# Altium schematic sheet Schematic_RX.schdoc
size A1
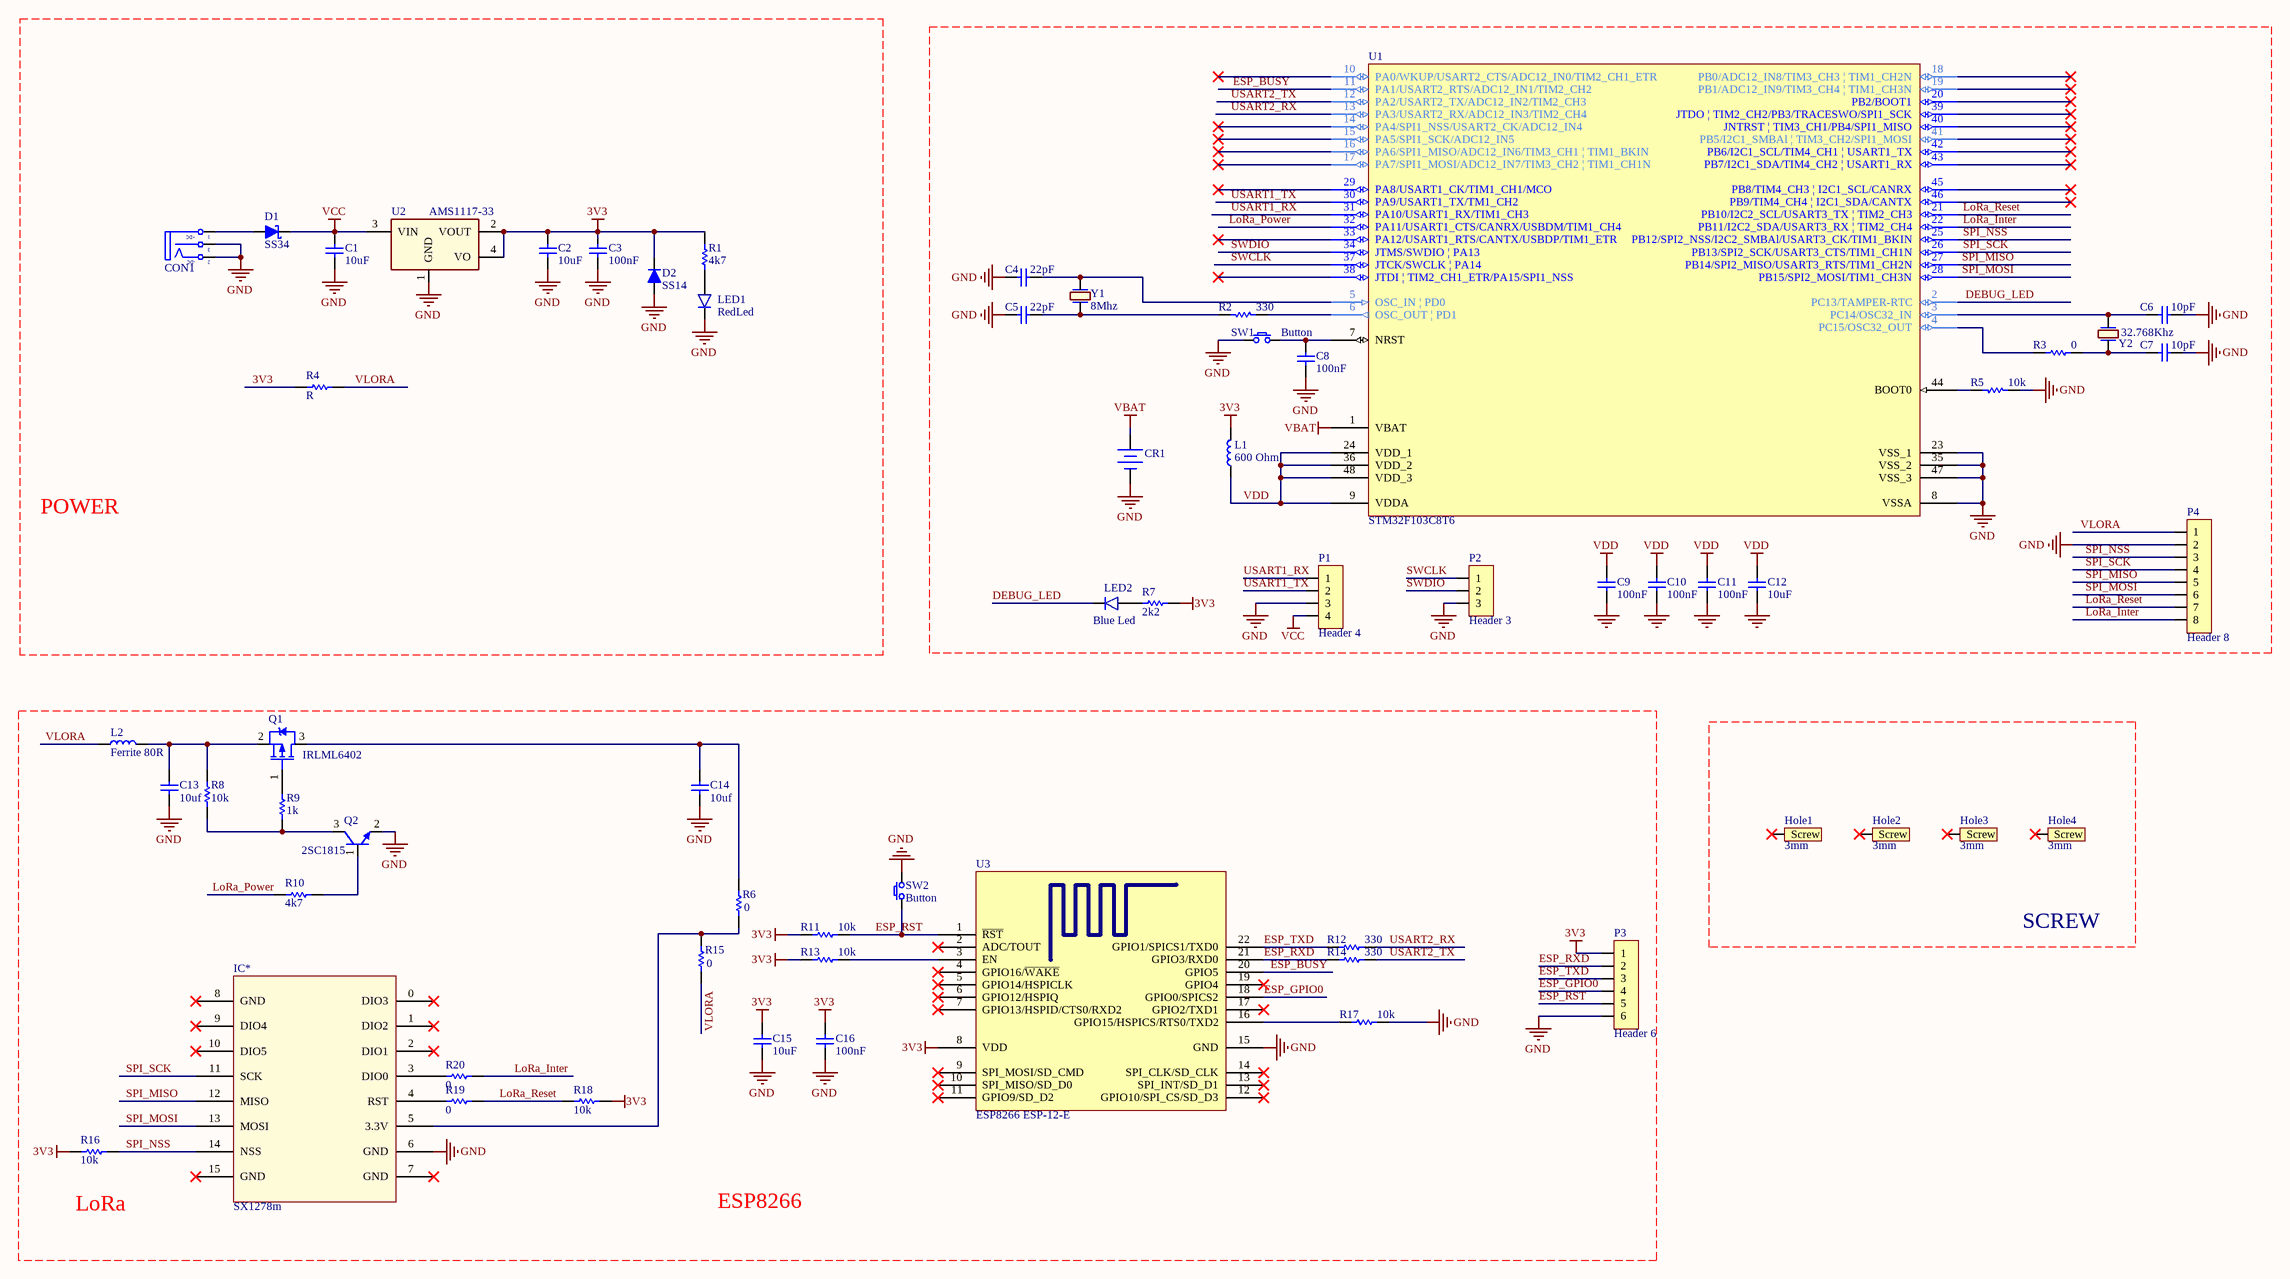
[diagram p0: Schematic_RX.schdoc]

## Parts
C1  10uF  [C 0805 (2012)]
C2  10uF  [C 0805 (2012)]
C3  100nF  [C 0805 (2012)]
C4  22pF  [C 0805 (2012)]
C5  22pF  [C 0805 (2012)]
C6  10pF  [C 0805 (2012)]
C7  10pF  [C 0805 (2012)]
C8  100nF  [C 0805 (2012)]
C9  100nF  [C 0805 (2012)]
C10  100nF  [C 0805 (2012)]
C11  100nF  [C 0805 (2012)]
C12  10uF  [C 0805 (2012)]
C13  10uf  [C 0805 (2012)]
C14  10uf  [C 0805 (2012)]
C15  10uF  [C 0805 (2012)]
C16  100nF  [C 0805 (2012)]
CON1  CON DC PWR  [CON DC-044]  (value not drawn)
CR1  (no value)  [CON CR1220]
D1  SS34  [DO-214AC (SMA)]
D2  SS14  [DO-214AC (SMA)]
Hole1  3mm  [SCREW/3M/7M]
Hole2  3mm  [SCREW/3M/7M]
Hole3  3mm  [SCREW/3M/7M]
Hole4  3mm  [SCREW/3M/7M]
IC*  SX1278m  [SX1287m]
L1  600 Ohm  [Inductor SMD 0805 (2012)]
L2  Ferrite 80R  [Inductor SMD 0805 (2012)]
LED1  RedLed  [Led SMD 0805]
LED2  Blue Led  [Led SMD 0805]
P1  Header 4  [CON Header 4]
P2  Header 3  [Header 3]
P3  Header 6  [CON Header 6]
P4  Header 8  [Header 8]
Q1  IRLML6402  [SOT-23]
Q2  2SC1815  [SOT-23]
R1  4k7  [R 0805 (2012)]
R2  330  [R 0805 (2012)]
R3  0  [R 0805 (2012)]
R4  R  [R 0805 (2012)]
R5  10k  [R 0805 (2012)]
R6  0  [R 0805 (2012)]
R7  2k2  [R 0805 (2012)]
R8  10k  [R 0805 (2012)]
R9  1k  [R 0805 (2012)]
R10  4k7  [R 0805 (2012)]
R11  10k  [R 0805 (2012)]
R12  330  [R 0805 (2012)]
R13  10k  [R 0805 (2012)]
R14  330  [R 0805 (2012)]
R15  0  [R 0805 (2012)]
R16  10k  [R 0805 (2012)]
R17  10k  [R 0805 (2012)]
R18  10k  [R 0805 (2012)]
R19  0  [R 0805 (2012)]
R20  0  [R 0805 (2012)]
SW1  Button  [SW/2/SMD]
SW2  Button  [SW/2/SMD]
U1  STM32F103C8T6  [LQFP48_N]
U2  AMS1117-33  [SOT-223]
U3  ESP8266 ESP-12-E  [ESP8266 ESP-12-E]
Y1  8Mhz  [Crystal HC49US SMD]
Y2  32.768Khz  [Crystal DIP-2]

## Nets
3V3: C2.1 C3.1 C15.1 C16.1 D2.2(K) L1.2 P3.1 R1.1 R4.1 R7.2 R11.2 R13.2 R16.1 R18.1 U2.2(VOUT) U2.4(VO) U3.8(VDD)
GND: C1.2 C2.2 C3.2 C4.2 C5.2 C6.2 C7.2 C8.2 C9.2 C10.2 C11.2 C12.2 C13.2 C14.2 C15.2 C16.2 CON1.2(TN) CON1.3(S) CR1.2(GND) D2.1(A) IC*.6(GND) LED1.2(K) P1.3 P2.3 P3.6 P4.2 Q2.2(E) R5.1 R17.1 SW1.1 SW2.2 U1.8(VSSA) U1.23(VSS_1) U1.35(VSS_2) U1.47(VSS_3) U2.1(GND) U3.15(GND)
VBAT: CR1.1(VCC) U1.1(VBAT)
VCC: C1.1 D1.2(K) P1.4 U2.3(VIN)
VDD: C9.1 C10.1 C11.1 C12.1 L1.1 U1.9(VDDA) U1.24(VDD_1) U1.36(VDD_2) U1.48(VDD_3)
DEBUG_LED: LED2.2(K) U1.2(PC13/TAMPER-RTC)
ESP_BUSY: U1.11(PA1/USART2_RTS/ADC12_IN1/TIM2_CH2) U3.20(GPIO5)
ESP_GPIO0: P3.4 U3.18(GPIO0/SPICS2)
ESP_RST: P3.5 R11.1 SW2.1 U3.1(~{RST})
ESP_RXD: P3.2 R14.2 U3.21(GPIO3/RXD0)
ESP_TXD: P3.3 R12.2 U3.22(GPIO1/SPICS1/TXD0)
LoRa_Inter: P4.8 R20.2 U1.22(PB11/I2C2_SDA/USART3_RX_|_TIM2_CH4)
LoRa_Power: R10.1 U1.32(PA11/USART1_CTS/CANRX/USBDM/TIM1_CH4)
LoRa_Reset: P4.7 R18.2 R19.2 U1.21(PB10/I2C2_SCL/USART3_TX_|_TIM2_CH3)
SPI_MISO: IC*.12(MISO) P4.5 U1.27(PB14/SPI2_MISO/USART3_RTS/TIM1_CH2N)
SPI_MOSI: IC*.13(MOSI) P4.6 U1.28(PB15/SPI2_MOSI/TIM1_CH3N)
SPI_NSS: IC*.14(NSS) P4.3 R16.2 U1.25(PB12/SPI2_NSS/I2C2_SMBAl/USART3_CK/TIM1_BKIN)
SPI_SCK: IC*.11(SCK) P4.4 U1.26(PB13/SPI2_SCK/USART3_CTS/TIM1_CH1N)
SWCLK: P2.1 U1.37(JTCK/SWCLK_|_PA14)
SWDIO: P2.2 U1.34(JTMS/SWDIO_|_PA13)
USART1_RX: P1.1 U1.31(PA10/USART1_RX/TIM1_CH3)
USART1_TX: P1.2 U1.30(PA9/USART1_TX/TM1_CH2)
USART2_RX: R12.1 U1.13(PA3/USART2_RX/ADC12_IN3/TIM2_CH4)
USART2_TX: R14.1 U1.12(PA2/USART2_TX/ADC12_IN2/TIM2_CH3)
VLORA: L2.1 P4.1 R4.2 R15.1
NetC4_1: C4.1 U1.5(OSC_IN_|_PD0) Y1.2
NetC5_1: C5.1 R2.2 Y1.1
NetC6_1: C6.1 U1.3(PC14/OSC32_IN) Y2.2
NetC7_1: C7.1 R3.2 Y2.1
NetC8_1: C8.1 SW1.2 U1.7(NRST)
NetC13_1: C13.1 L2.2 Q1.2(S) R8.2
NetC14_1: C14.1 Q1.3(D) R6.2
NetCON1_1: CON1.1(T) D1.1(A)
NetIC*_3: IC*.3(DIO0) R20.1
NetIC*_4: IC*.4(RST) R19.1
NetIC*_5: IC*.5(3.3V) R6.1 R15.2
NetLED1_1: LED1.1(A) R1.2
NetLED2_1: LED2.1(A) R7.1
NetQ1_1: Q1.1(G) R9.2
NetQ2_1: Q2.1(B) R10.2
NetQ2_3: Q2.3(C) R8.1 R9.1
NetR2_1: R2.1 U1.6(OSC_OUT_|_PD1)
NetR3_1: R3.1 U1.4(PC15/OSC32_OUT)
NetR5_2: R5.2 U1.44(BOOT0)
NetR13_1: R13.1 U3.3(EN)
NetR17_2: R17.2 U3.16(GPIO15/HSPICS/RTS0/TXD2)

Not connected (* = marked no-connect by the designer): Hole1 1(Screw)*; Hole2 1(Screw)*; Hole3 1(Screw)*; Hole4 1(Screw)*; IC* 0(DIO3)* 1(DIO2)* 2(DIO1)* 7(GND)* 8(GND)* 9(DIO4)* 10(DIO5)* 15(GND)*; U1 10(PA0/WKUP/USART2_CTS/ADC12_IN0/TIM2_CH1_ETR)* 14(PA4/SPI1_NSS/USART2_CK/ADC12_IN4)* 15(PA5/SPI1_SCK/ADC12_IN5)* 16(PA6/SPI1_MISO/ADC12_IN6/TIM3_CH1_|_TIM1_BKIN)* 17(PA7/SPI1_MOSI/ADC12_IN7/TIM3_CH2_|_TIM1_CH1N)* 18(PB0/ADC12_IN8/TIM3_CH3_|_TIM1_CH2N)* 19(PB1/ADC12_IN9/TIM3_CH4_|_TIM1_CH3N)* 20(PB2/BOOT1)* 29(PA8/USART1_CK/TIM1_CH1/MCO)* 33(PA12/USART1_RTS/CANTX/USBDP/TIM1_ETR)* 38(JTDI_|_TIM2_CH1_ETR/PA15/SPI1_NSS)* 39(JTDO_|_TIM2_CH2/PB3/TRACESWO/SPI1_SCK)* 40(JNTRST_|_TIM3_CH1/PB4/SPI1_MISO)* 41(PB5/I2C1_SMBAl_|_TIM3_CH2/SPI1_MOSI)* 42(PB6/I2C1_SCL/TIM4_CH1_|_USART1_TX)* 43(PB7/I2C1_SDA/TIM4_CH2_|_USART1_RX)* 45(PB8/TIM4_CH3_|_I2C1_SCL/CANRX)* 46(PB9/TIM4_CH4_|_I2C1_SDA/CANTX)*; U3 2(ADC/TOUT)* 4(GPIO16/~{WAKE})* 5(GPIO14/HSPICLK)* 6(GPIO12/HSPIQ)* 7(GPIO13/HSPID/CTS0/RXD2)* 9(SPI_MOSI/SD_CMD)* 10(SPI_MISO/SD_D0)* 11(GPIO9/SD_D2)* 12(GPIO10/SPI_CS/SD_D3)* 13(SPI_INT/SD_D1)* 14(SPI_CLK/SD_CLK)* 17(GPIO2/TXD1)* 19(GPIO4)*

## Notes on the sheet
- POWER
- SCREW
- (near R16) LoRa
- ESP8266
- (in symbol CON DC PWR) +DC; -DC

## Library data of the parts
C1-C16 = Capacitor NP: Capacitor non-pol
CON1 = CON DC PWR: DC input connector
CR1 = Battery
D1 = Diode Schottky: Schottky Diode; Published: 8-Jun-2000; LatestRevisionDate: 17-Jul-2002; LatestRevisionNote: Re-released for DXP Platform.; PackageReference: SMB; Publisher: Altium Limited; Code_JEDEC: DO-214-AA
D2 = Diode: Default Diode; Published: 8-Jun-2000; LatestRevisionDate: 17-Jul-2002; LatestRevisionNote: Re-released for DXP Platform.; PackageVersion: Sep-1996; PackageReference: SMC; Publisher: Altium Limited; Code_JEDEC: DO-214-AB
Hole1-Hole4 = Screw
IC* = SX1278m: SX1278 - Module LoRa
L1 = Inductor
L2 = Inductor: Ferrite
LED1 LED2 = Led: Typical LED
P1 = Header 4: Header, 4-Pin
P2 = Header 3: Header, 3-Pin
P3 = Header 6: Header, 6-Pin
P4 = Header 8: Header, 8-Pin; LatestRevisionDate: 17-Jul-2002; LatestRevisionNote: Re-released for DXP Platform.; Publisher: Altium Limited
Q1 = MOSFET P-Channel
Q2 = Transistor NPN: NPN Bipolar Transistor
R1-R20 = Resistor: Published: 8-Jun-2000; LatestRevisionDate: 17-Jul-2002; LatestRevisionNote: Re-released for DXP Platform.; PackageReference: AXIAL-0.3; Publisher: Altium Limited
SW1 SW2 = SW SPST: Tact switch 2 pin
U1 = STM32F103C8T6: STM32 ARM-based 32-bit MCU with 64 Kbytes Flash, 48-pin LQFP, Industrial Temperature; Published: 30-May-2008; DatasheetVersion: rev6, Mar-2008; PackageVersion: Mar-2008; PackageReference: LQFP48; Publisher: Altium Limited; PackageDescription: 48-Pin Low-Profile Quad Flat Pack, 7 x 7 mm Body, 0.5 mm Pitch (LQFP48); ComponentLink1Description: Manufacturer Link; ComponentLink1URL: www.st.com/stm32; ComponentLink2Description: Datasheet; ComponentLink2URL: http://www.st.com/stonline/products/literature/ds/13587.pdf
U2 = AMS1117: 1A LDO Voltage Regulator, ADJ or fixed 1.5/1.8/2.5/2.85/3.3/5V
Y1 Y2 = Crystal